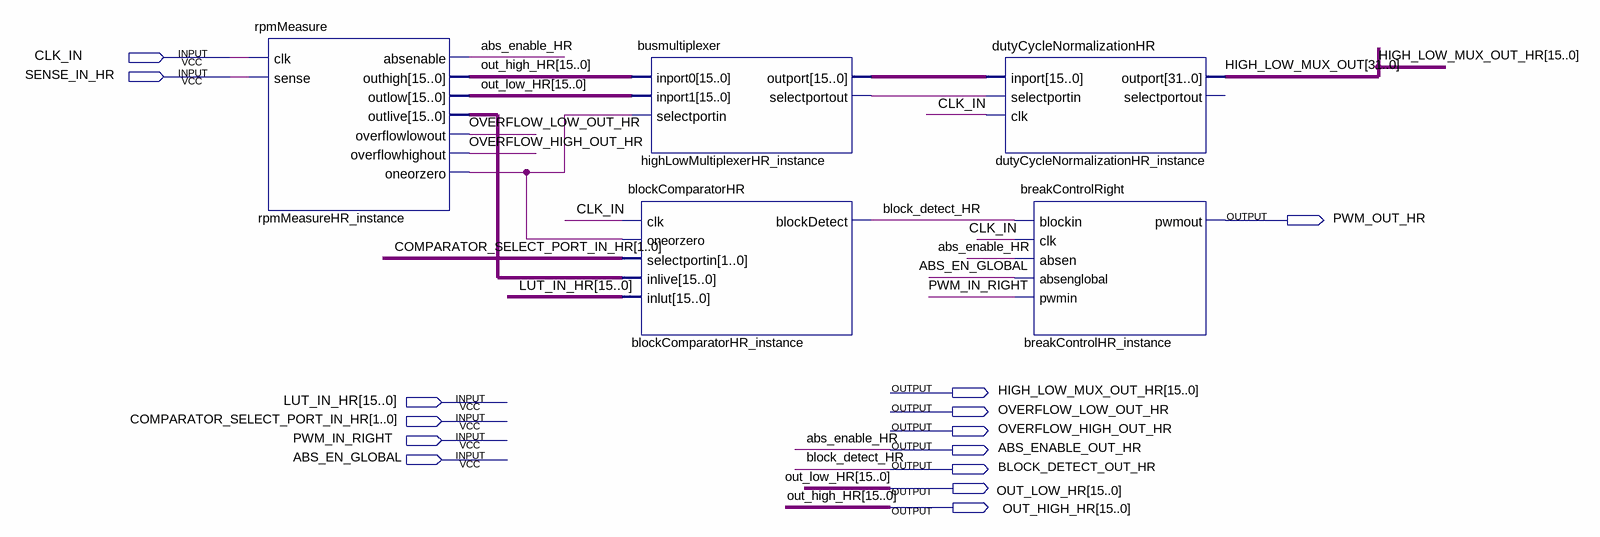
[diagram p0: schematic sheet]
// Quartus schematic absControlHR.bdf as structural Verilog: 5 symbols, 14 pins
module absControlHR (
  input  CLK_IN,
  input  SENSE_IN_HR,
  input  [15:0] LUT_IN_HR,
  input  [1:0] COMPARATOR_SELECT_PORT_IN_HR,
  input  PWM_IN_RIGHT,
  input  ABS_EN_GLOBAL,
  output PWM_OUT_HR,
  output [15:0] HIGH_LOW_MUX_OUT_HR,
  output OVERFLOW_LOW_OUT_HR,
  output OVERFLOW_HIGH_OUT_HR,
  output ABS_ENABLE_OUT_HR,
  output BLOCK_DETECT_OUT_HR,
  output [15:0] OUT_LOW_HR,
  output [15:0] OUT_HIGH_HR
);

  wire highLowMultiplexerHR_instance_selectportout, rpmMeasureHR_instance_oneorzero;
  wire [15:0] highLowMultiplexerHR_instance_outport, rpmMeasureHR_instance_outlive;
  wire [31:0] HIGH_LOW_MUX_OUT;

  rpmMeasure rpmMeasureHR_instance (
    .clk(CLK_IN), .sense(SENSE_IN_HR), .absenable(ABS_ENABLE_OUT_HR), .outhigh(OUT_HIGH_HR),
    .outlow(OUT_LOW_HR), .outlive(rpmMeasureHR_instance_outlive), .overflowlowout(OVERFLOW_LOW_OUT_HR),
    .overflowhighout(OVERFLOW_HIGH_OUT_HR), .oneorzero(rpmMeasureHR_instance_oneorzero));
  busmultiplexer highLowMultiplexerHR_instance (
    .inport0(OUT_HIGH_HR), .inport1(OUT_LOW_HR), .selectportin(rpmMeasureHR_instance_oneorzero),
    .outport(highLowMultiplexerHR_instance_outport),
    .selectportout(highLowMultiplexerHR_instance_selectportout));
  blockComparatorHR blockComparatorHR_instance (
    .clk(CLK_IN), .oneorzero(rpmMeasureHR_instance_oneorzero), .selectportin(COMPARATOR_SELECT_PORT_IN_HR),
    .inlive(rpmMeasureHR_instance_outlive), .inlut(LUT_IN_HR), .blockDetect(BLOCK_DETECT_OUT_HR));
  dutyCycleNormalizationHR dutyCycleNormalizationHR_instance (
    .inport(highLowMultiplexerHR_instance_outport),
    .selectportin(highLowMultiplexerHR_instance_selectportout), .clk(CLK_IN), .outport(HIGH_LOW_MUX_OUT));  // open: selectportout
  breakControlRight breakControlHR_instance (
    .blockin(BLOCK_DETECT_OUT_HR), .clk(CLK_IN), .absen(ABS_ENABLE_OUT_HR), .absenglobal(ABS_EN_GLOBAL),
    .pwmin(PWM_IN_RIGHT), .pwmout(PWM_OUT_HR));

  // Other names for the same wires on the sheet: abs_enable_HR = ABS_ENABLE_OUT_HR;
  //   block_detect_HR = BLOCK_DETECT_OUT_HR
endmodule
